# Altium schematic sheet HC-1.25-4PLT1_HC-1.25-4PLT.schdoc
size 127 x 99 mm
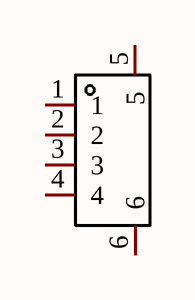
[diagram p0: HC-1.25-4PLT1_HC-1.25-4PLT.schdoc]

## Parts
CN?  HC-1.25-4PLT  [CONN-SMD_4P-P1.25_HCTL_HC-1.25-4PLT]  (value not drawn)

## Nets

Not connected (* = marked no-connect by the designer): CN? 1 2 3 4 5 6

## Library data of the parts
CN? = HC-1.25-4PLT: Manufacturer: HCTL(华灿天禄); Add into BOM: yes; Pins Structure: 1x4P; Pitch: 1.25mm; Number of PINs Per Row: 4; Current Rating (Max): 2A; Symbol: HC-1.25-4PLT; Device: HC-1.25-4PLT; LCSC Part Name: 1x4P 间距:1.25mm 立贴; Supplier Part: C2845390; Manufacturer Part: HC-1.25-4PLT; Supplier Footprint: SMD,P=1.25mm; JLCPCB Part Class: Extended Part; Datasheet: https://atta.szlcsc.com/upload/public/pdf/source/20230707/8E5913B5A3195C18F5EE12EA4CB86B82.pdf; Supplier: LCSC; Convert to PCB: yes; Mounting Style: 立贴; Reference Series: -; Number of Pins: 4P; Number of Rows: 1; Row Spacing: -; Contact Material: 黄铜; Contact Plating: 锡; Operating Temperature Range: -25℃~+85℃